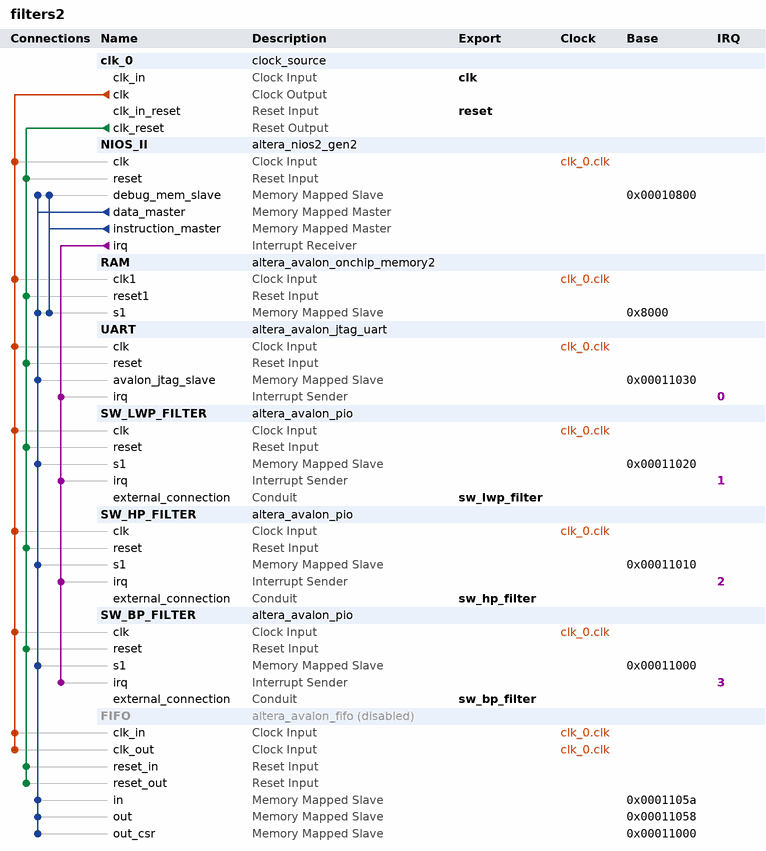
[diagram p0: system contents]
# Platform Designer (Qsys) system filters2, Cyclone V 5CSEMA5F31C6
# Parameters at their usual value, and those the tool derives, are not listed.
package require -exact qsys 18.1
create_system filters2
set_project_property DEVICE_FAMILY {Cyclone V}
set_project_property DEVICE 5CSEMA5F31C6

add_instance clk_0 clock_source 18.1
set_instance_parameter_value clk_0 clockFrequency 50000000

add_instance NIOS_II altera_nios2_gen2 18.1
set_instance_parameter_value NIOS_II dcache_size 2048
set_instance_parameter_value NIOS_II exceptionSlave RAM.s1
set_instance_parameter_value NIOS_II icache_size 4096
set_instance_parameter_value NIOS_II impl Tiny
set_instance_parameter_value NIOS_II resetSlave RAM.s1

add_instance RAM altera_avalon_onchip_memory2 18.1
set_instance_parameter_value RAM dataWidth 32
set_instance_parameter_value RAM dualPort false
set_instance_parameter_value RAM initMemContent true
set_instance_parameter_value RAM initializationFileName onchip_mem.hex
set_instance_parameter_value RAM memorySize 32768

add_instance UART altera_avalon_jtag_uart 18.1
set_instance_parameter_value UART simInteractiveOptions NO_INTERACTIVE_WINDOWS

add_instance SW_LWP_FILTER altera_avalon_pio 18.1
set_instance_parameter_value SW_LWP_FILTER direction Input
set_instance_parameter_value SW_LWP_FILTER generateIRQ true
set_instance_parameter_value SW_LWP_FILTER simDoTestBenchWiring true
set_instance_parameter_value SW_LWP_FILTER width 1

add_instance SW_HP_FILTER altera_avalon_pio 18.1
set_instance_parameter_value SW_HP_FILTER direction Input
set_instance_parameter_value SW_HP_FILTER generateIRQ true
set_instance_parameter_value SW_HP_FILTER simDoTestBenchWiring true
set_instance_parameter_value SW_HP_FILTER width 1

add_instance SW_BP_FILTER altera_avalon_pio 18.1
set_instance_parameter_value SW_BP_FILTER direction Input
set_instance_parameter_value SW_BP_FILTER generateIRQ true
set_instance_parameter_value SW_BP_FILTER simDoTestBenchWiring true
set_instance_parameter_value SW_BP_FILTER width 1

add_instance FIFO altera_avalon_fifo 18.1
set_instance_property FIFO ENABLED false
set_instance_parameter_value FIFO avalonMMAvalonMMDataWidth 16
set_instance_parameter_value FIFO bitsPerSymbol 16
set_instance_parameter_value FIFO channelWidth 8
set_instance_parameter_value FIFO errorWidth 8
set_instance_parameter_value FIFO fifoDepth 8
set_instance_parameter_value FIFO fifoInputInterfaceOptions AVALONMM_WRITE
set_instance_parameter_value FIFO fifoOutputInterfaceOptions AVALONMM_READ
set_instance_parameter_value FIFO singleClockMode false
set_instance_parameter_value FIFO symbolsPerBeat 2
set_instance_parameter_value FIFO useIRQ false
set_instance_parameter_value FIFO usePacket true
set_instance_parameter_value FIFO useReadControl true
set_instance_parameter_value FIFO useWriteControl false

# connections
add_connection clk_0.clk FIFO.clk_in clock
add_connection clk_0.clk FIFO.clk_out clock
add_connection clk_0.clk NIOS_II.clk clock
add_connection clk_0.clk RAM.clk1 clock
add_connection clk_0.clk SW_BP_FILTER.clk clock
add_connection clk_0.clk SW_HP_FILTER.clk clock
add_connection clk_0.clk SW_LWP_FILTER.clk clock
add_connection clk_0.clk UART.clk clock
add_connection clk_0.clk_reset FIFO.reset_in reset
add_connection clk_0.clk_reset FIFO.reset_out reset
add_connection clk_0.clk_reset NIOS_II.reset reset
add_connection clk_0.clk_reset RAM.reset1 reset
add_connection clk_0.clk_reset SW_BP_FILTER.reset reset
add_connection clk_0.clk_reset SW_HP_FILTER.reset reset
add_connection clk_0.clk_reset SW_LWP_FILTER.reset reset
add_connection clk_0.clk_reset UART.reset reset
add_connection NIOS_II.data_master FIFO.in avalon
set_connection_parameter_value NIOS_II.data_master/FIFO.in baseAddress 0x0001105a
add_connection NIOS_II.data_master FIFO.out avalon
set_connection_parameter_value NIOS_II.data_master/FIFO.out baseAddress 0x00011058
add_connection NIOS_II.data_master FIFO.out_csr avalon
set_connection_parameter_value NIOS_II.data_master/FIFO.out_csr baseAddress 0x00011000
add_connection NIOS_II.data_master NIOS_II.debug_mem_slave avalon
set_connection_parameter_value NIOS_II.data_master/NIOS_II.debug_mem_slave baseAddress 0x00010800
add_connection NIOS_II.data_master RAM.s1 avalon
set_connection_parameter_value NIOS_II.data_master/RAM.s1 baseAddress 0x8000
add_connection NIOS_II.data_master SW_BP_FILTER.s1 avalon
set_connection_parameter_value NIOS_II.data_master/SW_BP_FILTER.s1 baseAddress 0x00011000
add_connection NIOS_II.data_master SW_HP_FILTER.s1 avalon
set_connection_parameter_value NIOS_II.data_master/SW_HP_FILTER.s1 baseAddress 0x00011010
add_connection NIOS_II.data_master SW_LWP_FILTER.s1 avalon
set_connection_parameter_value NIOS_II.data_master/SW_LWP_FILTER.s1 baseAddress 0x00011020
add_connection NIOS_II.data_master UART.avalon_jtag_slave avalon
set_connection_parameter_value NIOS_II.data_master/UART.avalon_jtag_slave baseAddress 0x00011030
add_connection NIOS_II.instruction_master NIOS_II.debug_mem_slave avalon
set_connection_parameter_value NIOS_II.instruction_master/NIOS_II.debug_mem_slave baseAddress 0x00010800
add_connection NIOS_II.instruction_master RAM.s1 avalon
set_connection_parameter_value NIOS_II.instruction_master/RAM.s1 baseAddress 0x8000
add_connection NIOS_II.irq SW_BP_FILTER.irq interrupt
set_connection_parameter_value NIOS_II.irq/SW_BP_FILTER.irq irqNumber 3
add_connection NIOS_II.irq SW_HP_FILTER.irq interrupt
set_connection_parameter_value NIOS_II.irq/SW_HP_FILTER.irq irqNumber 2
add_connection NIOS_II.irq SW_LWP_FILTER.irq interrupt
set_connection_parameter_value NIOS_II.irq/SW_LWP_FILTER.irq irqNumber 1
add_connection NIOS_II.irq UART.irq interrupt
set_connection_parameter_value NIOS_II.irq/UART.irq irqNumber 0

# exported interfaces
add_interface clk clock sink
set_interface_property clk EXPORT_OF clk_0.clk_in
add_interface reset reset sink
set_interface_property reset EXPORT_OF clk_0.clk_in_reset
add_interface sw_bp_filter conduit end
set_interface_property sw_bp_filter EXPORT_OF SW_BP_FILTER.external_connection
add_interface sw_hp_filter conduit end
set_interface_property sw_hp_filter EXPORT_OF SW_HP_FILTER.external_connection
add_interface sw_lwp_filter conduit end
set_interface_property sw_lwp_filter EXPORT_OF SW_LWP_FILTER.external_connection

set_interconnect_requirement {$system} qsys_mm.clockCrossingAdapter HANDSHAKE
set_interconnect_requirement {$system} qsys_mm.enableEccProtection FALSE
set_interconnect_requirement {$system} qsys_mm.insertDefaultSlave FALSE
set_interconnect_requirement {$system} qsys_mm.maxAdditionalLatency 1

save_system filters2.qsys
